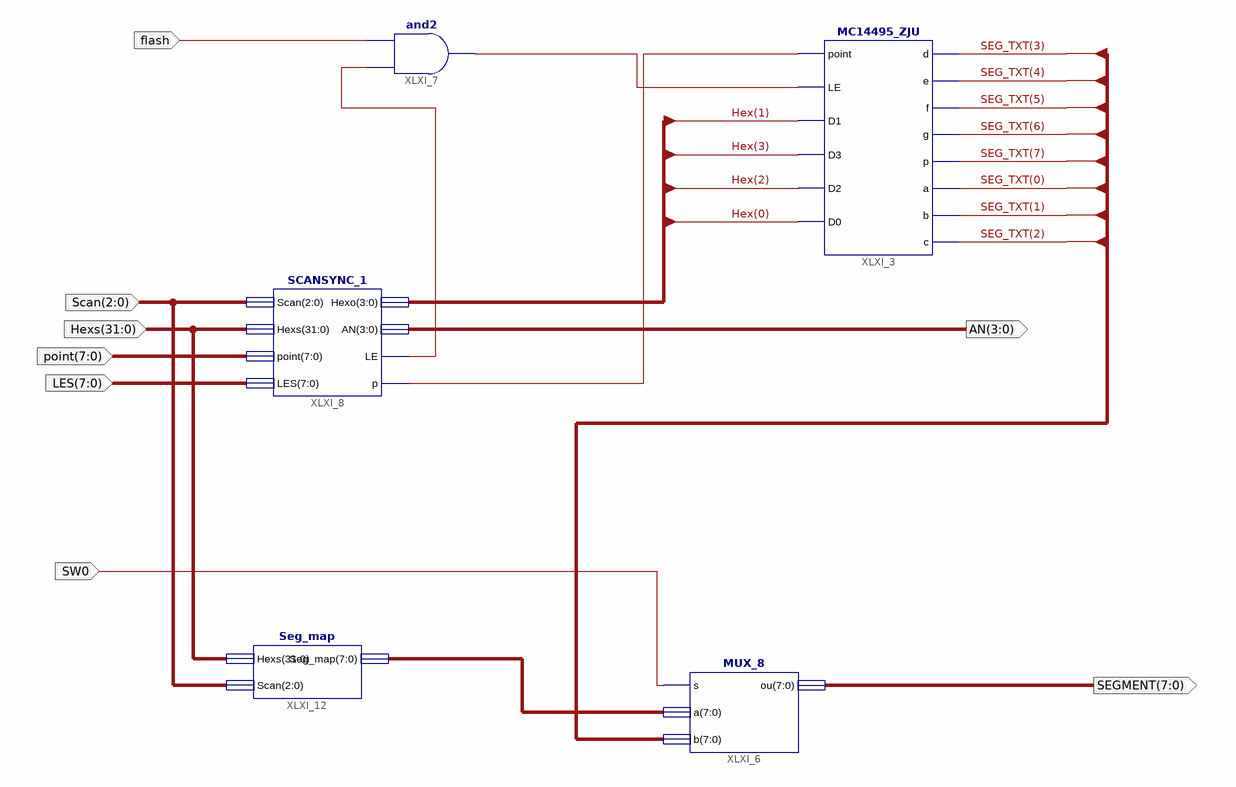
[diagram p0: schematic sheet 1]
// Xilinx ISE schematic Seg7_Dev.sch (kintex7) as structural Verilog: 5 symbols, 8 ports
module Seg7_Dev (
  input  flash,
  input  [7:0] point,
  input  [7:0] LES,
  input  SW0,
  input  [2:0] Scan,
  input  [31:0] Hexs,
  output [3:0] AN,
  output [7:0] SEGMENT
);

  wire XLXN_4, XLXN_5, XLXN_15;
  wire [3:0] Hex;
  wire [7:0] SEG_TXT, XLXN_22;

  MC14495_ZJU XLXI_3 (
    .point(XLXN_15), .LE(XLXN_5), .D1(Hex[1]), .D3(Hex[3]), .D2(Hex[2]), .D0(Hex[0]), .d(SEG_TXT[3]),
    .e(SEG_TXT[4]), .f(SEG_TXT[5]), .g(SEG_TXT[6]), .p(SEG_TXT[7]), .a(SEG_TXT[0]), .b(SEG_TXT[1]),
    .c(SEG_TXT[2]));
  MUX_8 XLXI_6 (.s(SW0), .a(XLXN_22), .b(SEG_TXT), .ou(SEGMENT));
  and XLXI_7 (XLXN_5, XLXN_4, flash);
  SCANSYNC_1 XLXI_8 (.Scan(Scan), .Hexs(Hexs), .point(point), .LES(LES), .Hexo(Hex), .AN(AN), .LE(XLXN_4), .p(XLXN_15));
  Seg_map XLXI_12 (.Hexs(Hexs), .Scan(Scan), .Seg_map(XLXN_22));
endmodule
